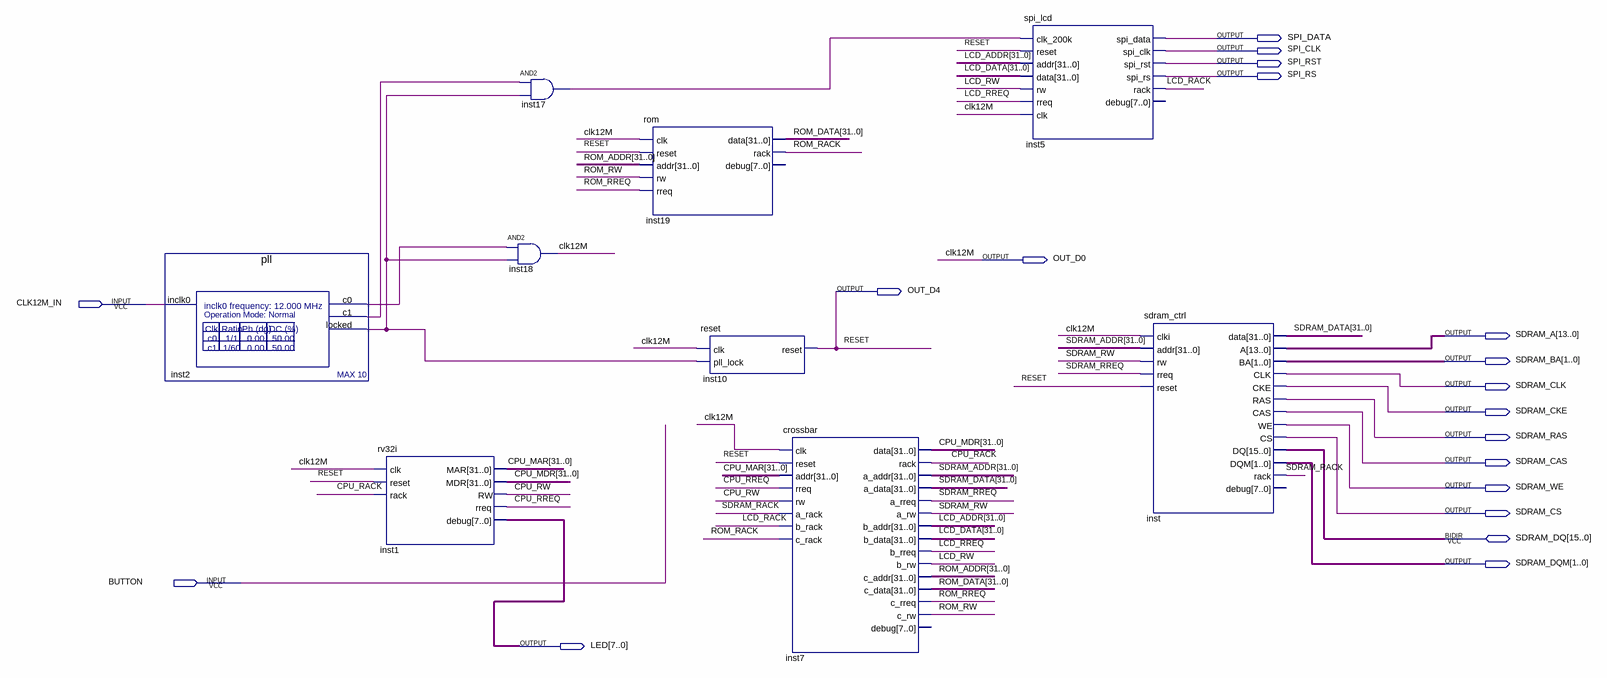
[diagram p0: schematic sheet]
// Quartus schematic mylib.bdf as structural Verilog: 9 symbols, 19 pins
module mylib (
  input  CLK12M_IN,
  input  BUTTON,
  inout  [15:0] SDRAM_DQ,
  output SPI_DATA,
  output SPI_CLK,
  output SPI_RST,
  output SPI_RS,
  output OUT_D0,
  output OUT_D4,
  output [13:0] SDRAM_A,
  output [1:0] SDRAM_BA,
  output SDRAM_CLK,
  output SDRAM_CKE,
  output SDRAM_RAS,
  output SDRAM_CAS,
  output SDRAM_WE,
  output SDRAM_CS,
  output [1:0] SDRAM_DQM,
  output [7:0] LED
);

  wire CPU_RACK, CPU_RREQ, CPU_RW, inst2_c0, inst2_c1, inst2_locked, inst17_out, LCD_RACK, LCD_RREQ, LCD_RW,
       ROM_RACK, ROM_RREQ, ROM_RW, SDRAM_RACK, SDRAM_RREQ, SDRAM_RW;
  wire [31:0] CPU_MAR, CPU_MDR, LCD_ADDR, LCD_DATA, ROM_ADDR, ROM_DATA, SDRAM_ADDR, SDRAM_DATA;

  pll inst2 (.inclk0(CLK12M_IN), .c0(inst2_c0), .c1(inst2_c1), .locked(inst2_locked));
  rv32i inst1 (
    .clk(OUT_D0), .reset(OUT_D4), .rack(CPU_RACK), .MAR(CPU_MAR), .RW(CPU_RW), .rreq(CPU_RREQ), .debug(LED),
    .MDR(CPU_MDR));
  and inst17 (inst17_out, inst2_c1, inst2_locked);
  and inst18 (OUT_D0, inst2_c0, inst2_locked);
  rom inst19 (
    .clk(OUT_D0), .reset(OUT_D4), .addr(ROM_ADDR), .rw(ROM_RW), .rreq(ROM_RREQ), .rack(ROM_RACK),
    .data(ROM_DATA));  // open: debug
  reset inst10 (.clk(OUT_D0), .pll_lock(inst2_locked), .reset(OUT_D4));
  crossbar inst7 (
    .clk(OUT_D0), .reset(OUT_D4), .addr(CPU_MAR), .rreq(CPU_RREQ), .rw(CPU_RW), .a_rack(SDRAM_RACK),
    .b_rack(LCD_RACK), .c_rack(ROM_RACK), .rack(CPU_RACK), .a_addr(SDRAM_ADDR), .a_rreq(SDRAM_RREQ),
    .a_rw(SDRAM_RW), .b_addr(LCD_ADDR), .b_rreq(LCD_RREQ), .b_rw(LCD_RW), .c_addr(ROM_ADDR),
    .c_rreq(ROM_RREQ), .c_rw(ROM_RW), .data(CPU_MDR), .a_data(SDRAM_DATA), .b_data(LCD_DATA),
    .c_data(ROM_DATA));  // open: debug
  spi_lcd inst5 (
    .clk_200k(inst17_out), .reset(OUT_D4), .addr(LCD_ADDR), .data(LCD_DATA), .rw(LCD_RW), .rreq(LCD_RREQ),
    .clk(OUT_D0), .spi_data(SPI_DATA), .spi_clk(SPI_CLK), .spi_rst(SPI_RST), .spi_rs(SPI_RS), .rack(LCD_RACK));  // open: debug
  sdram_ctrl inst (
    .clki(OUT_D0), .addr(SDRAM_ADDR), .rw(SDRAM_RW), .rreq(SDRAM_RREQ), .reset(OUT_D4), .A(SDRAM_A),
    .BA(SDRAM_BA), .CLK(SDRAM_CLK), .CKE(SDRAM_CKE), .RAS(SDRAM_RAS), .CAS(SDRAM_CAS), .WE(SDRAM_WE),
    .CS(SDRAM_CS), .DQM(SDRAM_DQM), .rack(SDRAM_RACK), .data(SDRAM_DATA), .DQ(SDRAM_DQ));  // open: debug

  // Other names for the same wires on the sheet: clk12M = OUT_D0; RESET = OUT_D4
endmodule
